# Altium project MicroSpecSensorBoard_V2_1.PrjPcb
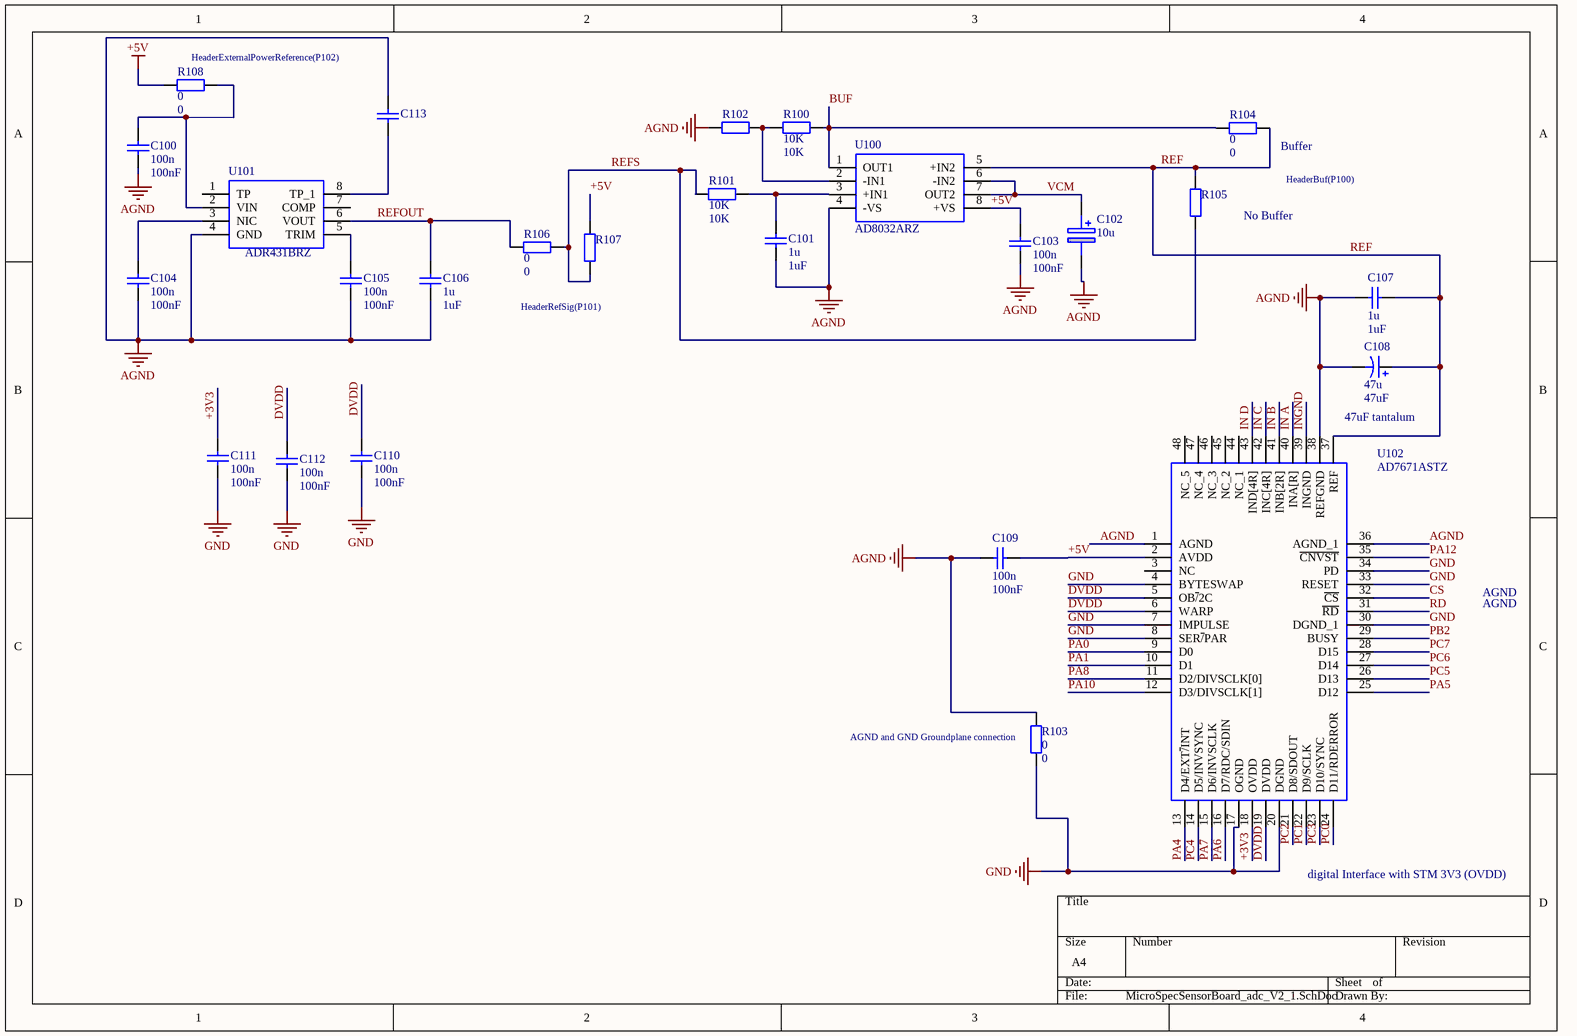
[diagram p0: MicroSpecSensorBoard_adc_V2_1.SchDoc]
5 sheets, 100 parts. Net scope: global (net labels, ports and power ports of the same name join across sheets).
Board file: MicroSpecSensorBoard_Layout_V2_1.PcbDoc
Sheets:
  MicroSpecSensorBoard_adc_V2_1.SchDoc
  MicroSpecSensorBoard_Connectors_V2_1.SchDoc
  MicroSpecSensorBoard_periphericDevices_V2_1.SchDoc
  MicroSpecSensorBoard_PowerSupply_V2_1.SchDoc
  MicroSpecSensorBoard_switch_V2_1.SchDoc

## Sheet MicroSpecSensorBoard_adc_V2_1.SchDoc
size A4

### Parts
C100  100n  value 100nF  [6-0805_L]
C101  1u  value 1uF  [6-0805_L]
C102  10u  [FKV(D)]
C103  100n  value 100nF  [6-0805_L]
C104  100n  value 100nF  [6-0805_L]
C105  100n  value 100nF  [6-0805_L]
C106  1u  value 1uF  [6-0805_L]
C107  1u  value 1uF  [6-0805_L]
C108  47u  value 47uF  [CAPCP-3216-18N]
C109  100n  value 100nF  [6-0805_L]
C110  100n  value 100nF  [6-0805_L]
C111  100n  value 100nF  [6-0805_L]
C112  100n  value 100nF  [6-0805_L]
C113  (no value)  [6-0805_N]
R100  10K  [6-0805_L]
R101  10K  [6-0805_L]
R102  (no value)  [6-0805_L]
R103  0  [6-0805_L]
R104  0  [6-0805_L]
R105  (no value)  [6-0805_L]
R106  0  [6-0805_L]
R107  (no value)  [6-0805_L]
R108  0  [6-0805_L]
U100  AD8032ARZ  [SOIC127P600X175-8N]
U101  ADR431BRZ  [SOIC127P600X175-8N]
U102  AD7671ASTZ  [QFP50P900X900X160-48N]

### Nets
+3V3: C111.1 U102.18(OVDD)
+5V: C103.1 C109.2 R107.2 R108.2 U100.8(+VS) U102.2(AVDD)
AGND: C100.2 C101.2 C102.2(-) C103.2 C104.2 C105.2 C106.2 C107.1 C108.2 C109.1 C113.1 R102.1 R103.2 U100.4(-VS) U101.4(GND) U102.1(AGND) U102.36(AGND_1) U102.38(REFGND)
GND: C110.2 C111.2 C112.2 R103.1 U102.4(BYTESWAP) U102.7(IMPULSE) U102.8(SER~{/}PAR) U102.17(OGND) U102.20(DGND) U102.30(DGND_1) U102.33(RESET) U102.34(PD)
BUF: R100.2 R104.2 U100.1(OUT1)
CS: U102.32(~{CS})
DVDD: C110.1 C112.1 U102.5(OB~{/}2C) U102.6(WARP) U102.19(DVDD)
IN A: U102.40(INA[R])
IN B: U102.41(INB[2R])
IN C: U102.42(INC[4R])
IN D: U102.43(IND[4R])
INGND: U102.39(INGND)
PA0: U102.9(D0)
PA1: U102.10(D1)
PA4: U102.13(D4/EXT~{/}INT)
PA5: U102.25(D12)
PA6: U102.16(D7/RDC/SDIN)
PA7: U102.15(D6/INVSCLK)
PA8: U102.11(D2/DIVSCLK[0])
PA10: U102.12(D3/DIVSCLK[1])
PA12: U102.35(~{CNVST})
PB2: U102.29(BUSY)
PC0: U102.24(D11/RDERROR)
PC1: U102.22(D9/SCLK)
PC2: U102.21(D8/SDOUT)
PC3: U102.23(D10/SYNC)
PC4: U102.14(D5/INVSYNC)
PC5: U102.26(D13)
PC6: U102.27(D14)
PC7: U102.28(D15)
RD: U102.31(~{RD})
REF: C107.2 C108.1 R104.1 R105.2 U100.5(+IN2) U102.37(REF)
REFOUT: C106.1 R106.2 U101.6(VOUT)
REFS: R101.1 R105.1 R106.1 R107.1
VCM: C102.1(+) U100.6(-IN2) U100.7(OUT2)
NetC100_1: C100.1 R108.1 U101.2(VIN)
NetC101_1: C101.1 R101.2 U100.3(+IN1)
NetC104_1: C104.1 U101.3(NIC)
NetC105_1: C105.1 U101.5(TRIM)
NetC113_2: C113.2 U101.8(TP_1)
NetR100_1: R100.1 R102.2 U100.2(-IN1)

Not connected (* = marked no-connect by the designer): U101 1(TP) 7(COMP); U102 3(NC) 44(NC_1) 45(NC_2) 46(NC_3) 47(NC_4) 48(NC_5)

### Notes on the sheet
- (near R108) HeaderExternalPowerReference(P102)
- (near R104) Buffer
- HeaderBuf(P100)
- (near R105) No Buffer
- HeaderRefSig(P101)
- 47uF tantalum
- AGND
- (near R103) AGND and GND Groundplane connection
- digital Interface with STM 3V3 (OVDD)

### Library data of the parts
C100 C101 C103-C107 C109-C112 = Cap: Capacitor; Published: 8-Jun-2000; LatestRevisionDate: 17-Jul-2002; LatestRevisionNote: Re-released for DXP Platform.; PackageReference: RAD-0.3; Publisher: Altium Limited; PackageDescription: Radial Cap, Thru-Hole; 2 Leads; 0.3 in Pin Spacing
C102 = EEEFK1J100P: Ecap 10uF; Manufacturer_Name: Panasonic; Allied_Number: 70256560; RS Part Number: 7083588P; Manufacturer_Part_Number: EEEFK1J100P; Datasheet Link: http://uk.rs-online.com/web/p/products/7083588P
C108 = Cap Pol2: Polarized Capacitor (Axial); Published: 8-Jun-2000; LatestRevisionDate: 17-Jul-2002; LatestRevisionNote: Re-released for DXP Platform.; PackageReference: POLAR0.8; Publisher: Altium Limited; PackageDescription: Polarized Capacitor; 2 Leads
C113 = Cap_1: Capacitor not populated; Published: 8-Jun-2000; LatestRevisionDate: 17-Jul-2002; LatestRevisionNote: Re-released for DXP Platform.; PackageReference: RAD-0.3; Publisher: Altium Limited; PackageDescription: Radial Cap, Thru-Hole; 2 Leads; 0.3 in Pin Spacing
R100 R101 R103-R108 = Res2: Resistor; Published: 8-Jun-2000; LatestRevisionDate: 17-Jul-2002; LatestRevisionNote: Re-released for DXP Platform.; PackageReference: AXIAL-0.4; Publisher: Altium Limited; PackageDescription: Axial Device, Thru-Hole; 2 Leads; 0.4 in Pin Spacing
  R100 R101: Value: 10K
  R103 R104 R106 R108: Value: 0
R102 = Res2: Resistor not populated; Published: 8-Jun-2000; LatestRevisionDate: 17-Jul-2002; LatestRevisionNote: Re-released for DXP Platform.; PackageReference: AXIAL-0.4; Publisher: Altium Limited; PackageDescription: Axial Device, Thru-Hole; 2 Leads; 0.4 in Pin Spacing
U100 = AD8032ARZ: Analog Devices AD8032ARZ, Dual Op Amp Rail-Rail, 5 V, 8-Pin SOIC; Manufacturer_Name: Analog Devices; Manufacturer_Part_Number: AD8032ARZ; RS Part Number: 0195105P; RS Price/Stock: http://uk.rs-online.com/web/p/products/0195105P; Arrow Part Number: AD8032ARZ; Arrow Price/Stock: http://uk.rs-online.com/web/p/products/0195105P; Datasheet Link: *
U101 = ADR431BRZ: ADR431BRZ, Precision Voltage Reference 2.499 to 2.501V, 0.04% 30mA 20V max. 8-Pin SOIC; Manufacturer_Name: Analog Devices; Geometry.Height: 1.75mm; Manufacturer_Part_Number: ADR431BRZ; RS Part Number: 9126366; RS Price/Stock: http://uk.rs-online.com/web/p/products/9126366; Arrow Part Number: ADR431BRZ; Arrow Price/Stock: https://www.arrow.com/en/products/adr431brz/analog-devices; Datasheet Link: http://www.analog.com/static/imported-files/data_sheets/ADR430_431_433_434_435.pdf
U102 = AD7671ASTZ: AD7671ASTZ, 16-Bit Analogue to Digital Converter, Serial, 48-Pin LQFP; Manufacturer_Name: Analog Devices; Geometry.Height: 1.6mm; Manufacturer_Part_Number: AD7671ASTZ; RS Part Number: 1580250; RS Price/Stock: http://uk.rs-online.com/web/p/products/1580250; Arrow Part Number: AD7671ASTZ; Arrow Price/Stock: https://www.arrow.com/en/products/ad7671astz/analog-devices; Datasheet Link: http://www.analog.com/static/imported-files/data_sheets/AD7671.pdf

## Sheet MicroSpecSensorBoard_Connectors_V2_1.SchDoc: Extension connectors
size A4; DocumentNumber: MB1136; Revision: C.3; SheetNumber: 4; SheetTotal: 4; Project: NUCLEO-XXXXRX
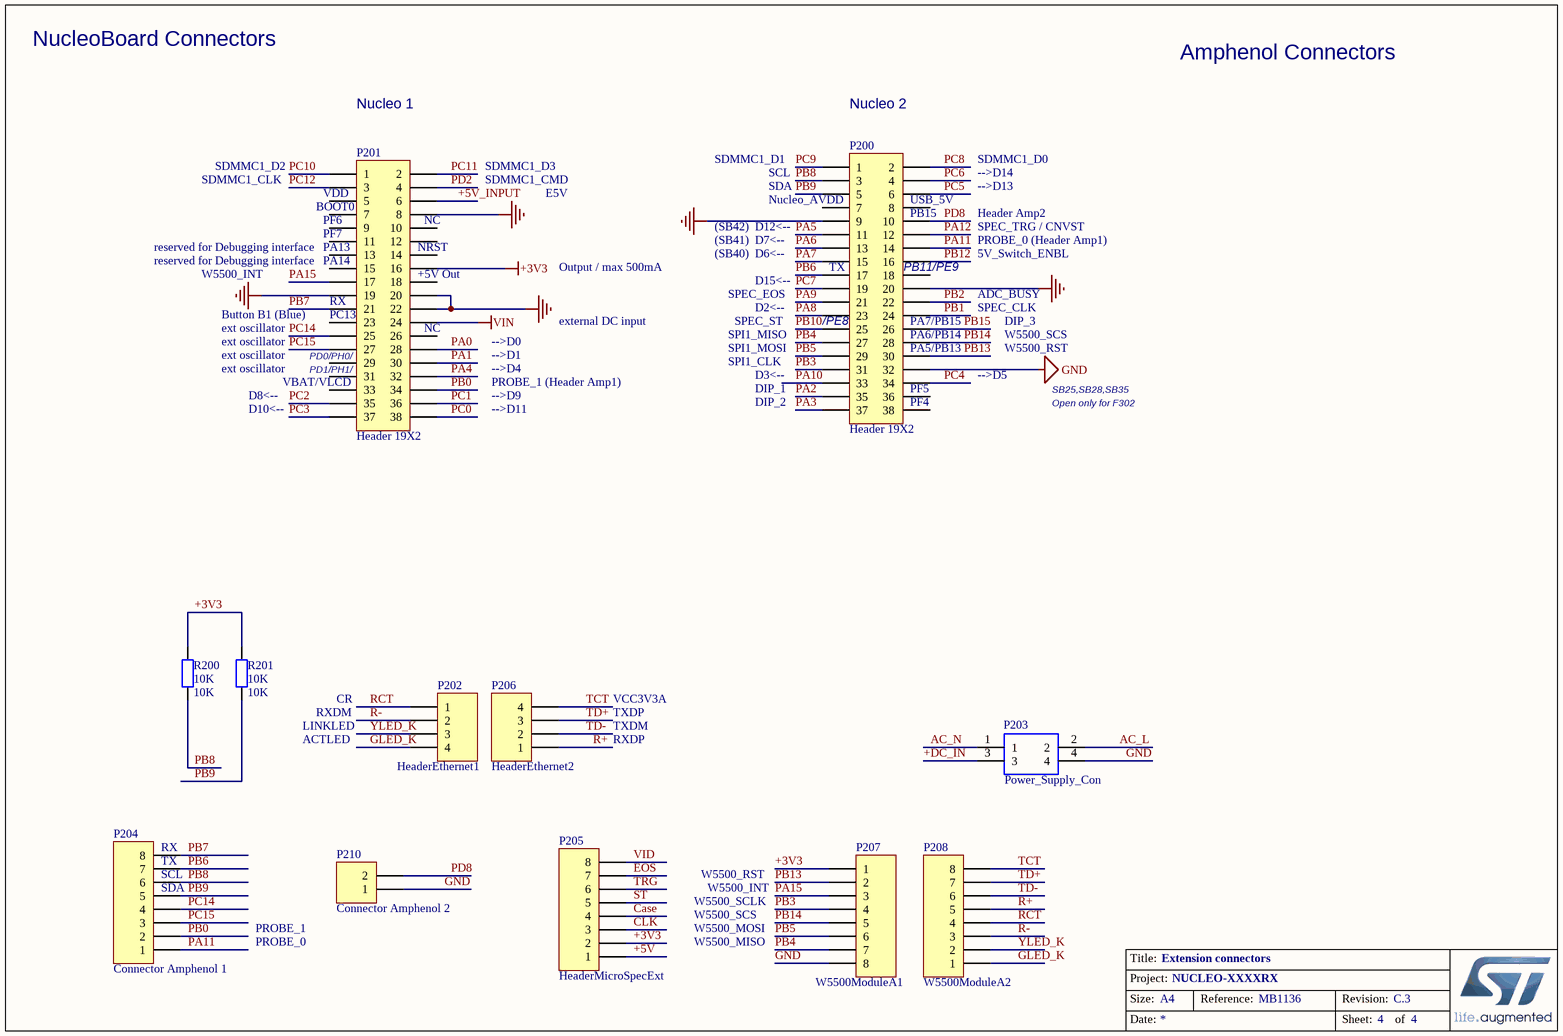
[diagram p1: MicroSpecSensorBoard_Connectors_V2_1.SchDoc]

### Parts
P200  Header 19X2  [HDR2X19]
P201  Header 19X2  [HDR2X19]
P202  HeaderEthernet1  [HDR1X4]
P203  Power_Supply_Con  [1864053]
P204  Connector Amphenol 1  [HDR1X8 - phoenix]
P205  HeaderMicroSpecExt  [HDR1X8]
P206  HeaderEthernet2  [HDR1X4]
P207  W5500ModuleA1  [HDR1X8]
P208  W5500ModuleA2  [HDR1X8]
P210  Connector Amphenol 2  [HDR1X2 - phoenix]
R200  10K  [6-0805_L]
R201  10K  [6-0805_L]

### Nets
+3V3: P201.16 P205.2 P207.1 R200.2 R201.2
+5V: P205.1
GND: P200.9 P200.20 P200.32 P201.8 P201.19 P201.20 P201.22 P203.4 P207.8 P210.1
VIN: P201.24
+5V_INPUT: P201.6
+DC_IN: P203.3
AC_L: P203.2
AC_N: P203.1
Case: P205.4
CLK: P205.3
EOS: P205.7
GLED_K: P202.4 P208.1
PA0: P201.28
PA1: P201.30
PA2: P200.35
PA3: P200.37
PA4: P201.32
PA5: P200.11
PA6: P200.13
PA7: P200.15
PA8: P200.23
PA9: P200.21
PA10: P200.33
PA11: P200.14 P204.1
PA12: P200.12
PA15: P201.17 P207.3
PB0: P201.34 P204.2
PB1: P200.24
PB2: P200.22
PB3: P200.31 P207.4
PB4: P200.27 P207.7
PB5: P200.29 P207.6
PB6: P200.17 P204.7
PB7: P201.21 P204.8
PB8: P200.3 P204.6 R200.1
PB9: P200.5 P204.5 R201.1
PB10: P200.25
PB12: P200.16
PB13: P200.30 P207.2
PB14: P200.28 P207.5
PB15: P200.26
PC0: P201.38
PC1: P201.36
PC2: P201.35
PC3: P201.37
PC4: P200.34
PC5: P200.6
PC6: P200.4
PC7: P200.19
PC8: P200.2
PC9: P200.1
PC10: P201.1
PC11: P201.2
PC12: P201.3
PC14: P201.25 P204.4
PC15: P201.27 P204.3
PD2: P201.4
PD8: P200.10 P210.2
R+: P206.1 P208.5
R-: P202.2 P208.3
RCT: P202.1 P208.4
ST: P205.5
TCT: P206.4 P208.8
TD+: P206.3 P208.7
TD-: P206.2 P208.6
TRG: P205.6
VID: P205.8
YLED_K: P202.3 P208.2

Not connected (* = marked no-connect by the designer): P200 7 8 18 36 38; P201 5 7 9 10 11 12 13 14 15 18 23 26 29 31 33

### Notes on the sheet
- NucleoBoard Connectors
- Nucleo 1
- Nucleo 2
- Amphenol Connectors
- SDMMC1_D2
- SDMMC1_D3
- SDMMC1_D1
- SCL
- SDMMC1_D0
- -->D14
- (near P201) reserved for Debugging interface
- SDMMC1_CLK
- (near P201) BOOT0
- (near P201) VDD
- (near P201) PF6
- (near P201) PF7
- (near P201) PA13
- (near P201) NRST
- (near P201) NC
- SDMMC1_CMD
- E5V
- (SB42)
- (SB41)
- D7<--
- D12<--
- SDA
- (near P200) Nucleo_AVDD
- (near P200) USB_5V
- (near P200) PB15
- -->D13
- SPEC_TRG / CNVST
- PROBE_0 (Header Amp1)
- Header Amp2
- W5500_INT
- (near P201) PA14
- (near P201) RX
- (near P201) +5V Out
- Output / max 500mA
- (SB40)
- SPEC_EOS
- D15<--
- D6<--
- D2<--
- (near P200) TX
- (near P200) PB11/PE9
- 5V_Switch_ENBL
- ADC_BUSY
- SPEC_CLK
- (near P201) ext oscillator
- (near P201) Button B1 (Blue)
- (near P201) VBAT/VLCD
- (near P201) PD0/PH0/
- (near P201) PD1/PH1/
- (near P201) PC13
- PROBE_1 (Header Amp1)
- -->D4
- -->D1
- -->D0
- external DC input
- SPI1_MISO
- SPI1_MOSI
- SPI1_CLK
- SPEC_ST
- D3<--
- (near P200) /PE8
- (near P200) PA7/PB15
- (near P200) PA6/PB14
- (near P200) PA5/PB13
- -->D5
- DIP_3
- W5500_SCS
- W5500_RST
- D8<--
- D10<--
- -->D11
- -->D9
- DIP_2
- DIP_1
- (near P200) PF5
- (near P200) PF4
- Open only for F302
- SB25,SB28,SB35
- RXDM
- CR
- VCC3V3A
- TXDP
- LINKLED
- ACTLED
- TXDM
- RXDP
- (near P204) RX
- (near P204) SCL
- (near P204) SDA
- (near P204) TX
- W5500_SCLK
- PROBE_1
- PROBE_0
- W5500_MOSI
- W5500_MISO
- Title:
- Project:
- Size:
- Date:
- A4
- Reference:
- Sheet:
- Revision:
- of

### Library data of the parts
P200 P201 = Header 19X2: Header, 19-Pin, Dual row; LatestRevisionDate: 17-Jul-2002; LatestRevisionNote: Re-released for DXP Platform.; Publisher: Altium Limited
P202 P206 = Header 4: Header, 4-Pin; LatestRevisionDate: 17-Jul-2002; LatestRevisionNote: Re-released for DXP Platform.; Publisher: Altium Limited
P203 = 1864053: Push spring connector 5mm pitch 4 way Phoenix Contact SDC Series 5mm Pitch Straight Pluggable Terminal Block, Plug with Plug In Termination, PCB Mount, 4 Way; Geometry.Height: 16mm; RS Part Number: 1113745; Manufacturer_Name: Phoenix Contact; Manufacturer_Part_Number: 1864053; Datasheet Link: http://uk.rs-online.com/web/p/products/1113745
P204 = MHDR1X8: Header, 8-Pin Phönix Contact; LatestRevisionDate: 17-Jul-2002; LatestRevisionNote: Re-released for DXP Platform.; Publisher: Altium Limited
P205 P207 P208 = Header 8: Header, 8-Pin; LatestRevisionDate: 17-Jul-2002; LatestRevisionNote: Re-released for DXP Platform.; Publisher: Altium Limited
P210 = MHDR1X2: Header, 2-Pin, MKDSN1,5 / 2, Phönix Contact; Publisher: UFZ Leipzig
R200 R201 = Res2: Resistor; Published: 8-Jun-2000; LatestRevisionDate: 17-Jul-2002; LatestRevisionNote: Re-released for DXP Platform.; PackageReference: AXIAL-0.4; Publisher: Altium Limited; PackageDescription: Axial Device, Thru-Hole; 2 Leads; 0.4 in Pin Spacing; Value: 10K

## Sheet MicroSpecSensorBoard_periphericDevices_V2_1.SchDoc
size A4
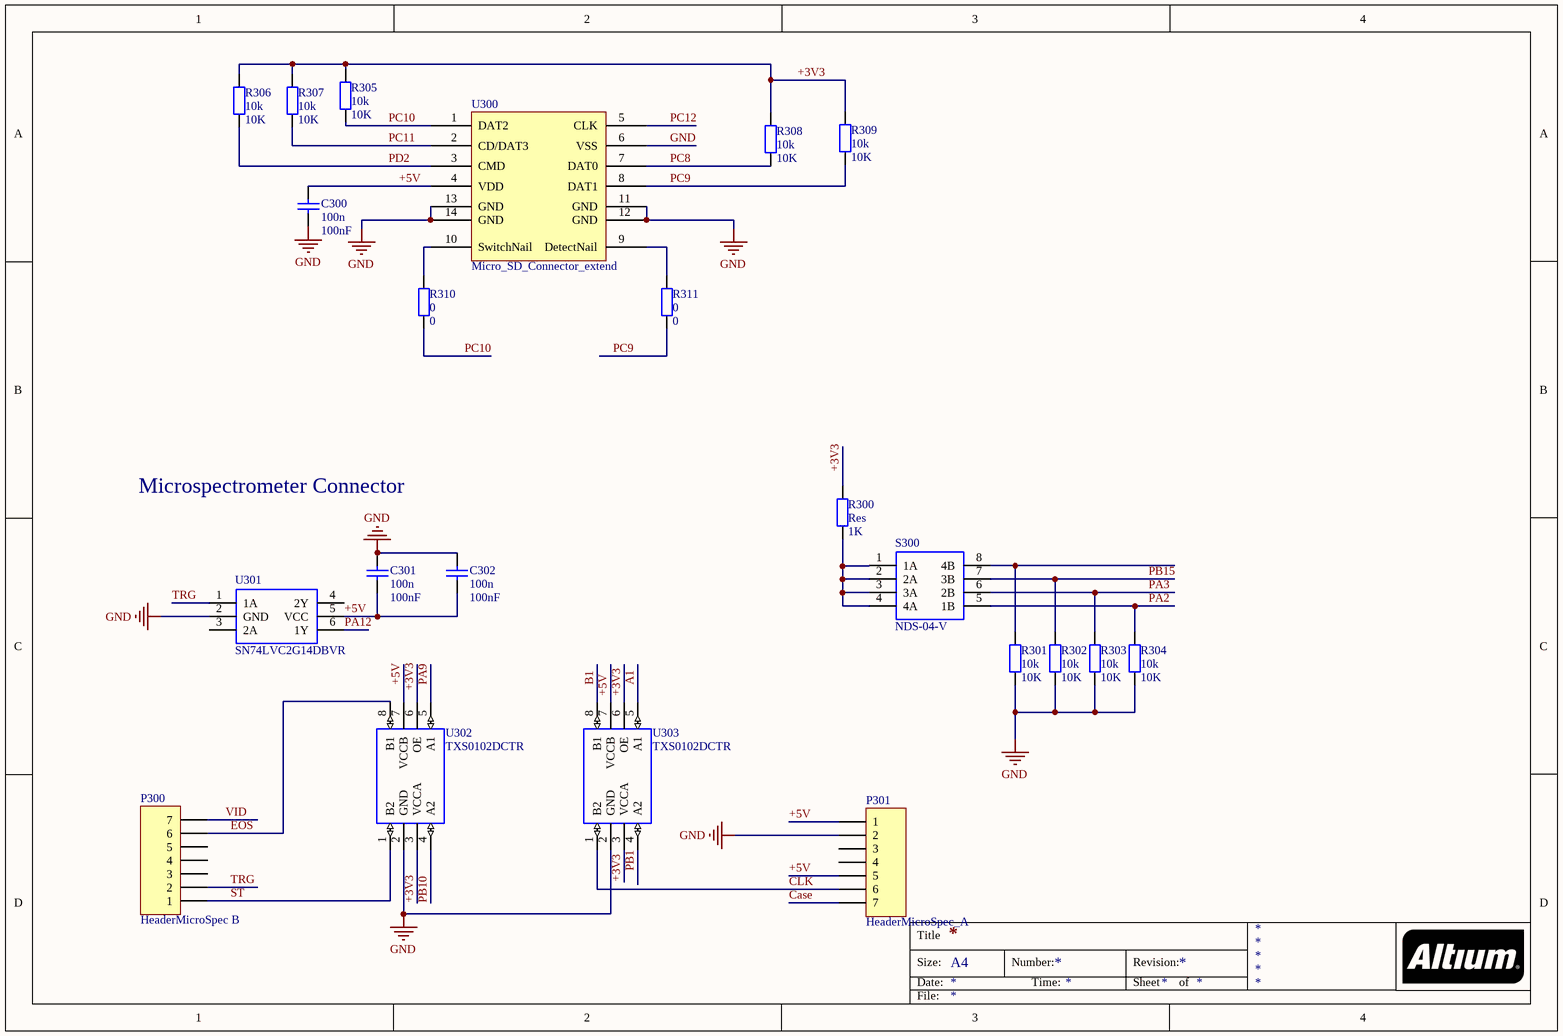
[diagram p2: MicroSpecSensorBoard_periphericDevices_V2_1.SchDoc]

### Parts
C300  100n  value 100nF  [6-0805_L]
C301  100n  value 100nF  [6-0805_L]
C302  100n  value 100nF  [6-0805_L]
P300  HeaderMicroSpec B  [HDR1X7]
P301  HeaderMicroSpec_A  [HDR1X7]
R300  Res  value 1K  [6-0805_L]
R301  10k  [6-0805_L]
R302  10k  [6-0805_L]
R303  10k  [6-0805_L]
R304  10k  [6-0805_L]
R305  10k  [6-0805_L]
R306  10k  [6-0805_L]
R307  10k  [6-0805_L]
R308  10k  [6-0805_L]
R309  10k  [6-0805_L]
R310  0  [6-0805_L]
R311  0  [6-0805_L]
S300  NDS-04-V  [DIPS762W60P254L1152H705Q8N]
U300  Micro_SD_Connector_extend  [MICRO-SD-CON-EXT]
U301  SN74LVC2G14DBVR  [SOT95P280X145-6N]
U302  TXS0102DCTR  [SOP65P400X130-8N]
U303  TXS0102DCTR  [SOP65P400X130-8N]

### Nets
+3V3: R300.2 R305.2 R306.2 R307.2 R308.1 R309.2 U302.3(VCCA) U302.6(OE) U303.3(VCCA) U303.6(OE)
+5V: C300.1 C301.2 C302.2 P301.1 P301.5 U300.4(VDD) U301.5(VCC) U302.7(VCCB) U303.7(VCCB)
GND: C300.2 C301.1 C302.1 P301.2 R301.1 R302.1 R303.1 R304.1 U300.6(VSS) U300.11(GND) U300.12(GND) U300.13(GND) U300.14(GND) U301.2(GND) U302.2(GND) U303.2(GND)
A1: U303.5(A1)
B1: U303.8(B1)
Case: P301.7
CLK: P301.6 U303.1(B2)
EOS: P300.6 U302.8(B1)
PA2: R304.2 S300.5(1B)
PA3: R303.2 S300.6(2B)
PA9: U302.5(A1)
PA12: U301.6(1Y)
PB1: U303.4(A2)
PB10: U302.4(A2)
PB15: R302.2 S300.7(3B)
PC8: R308.2 U300.7(DAT0)
PC9: R309.1 R311.1 U300.8(DAT1)
PC10: R305.1 R310.1 U300.1(DAT2)
PC11: R307.1 U300.2(CD/DAT3)
PC12: U300.5(CLK)
PD2: R306.1 U300.3(CMD)
ST: P300.1 U302.1(B2)
TRG: P300.2 U301.1(1A)
VID: P300.7
NetR300_1: R300.1 S300.1(1A) S300.2(2A) S300.3(3A) S300.4(4A)
NetR301_2: R301.2 S300.8(4B)
NetR310_2: R310.2 U300.10(SwitchNail)
NetR311_2: R311.2 U300.9(DetectNail)

Not connected (* = marked no-connect by the designer): P300 3 4 5; P301 3 4; U301 3(2A) 4(2Y)

### Notes on the sheet
- Microspectrometer Connector
- Title
- Size:
- Date:
- A4
- Number:
- Time:
- Revision:
- Sheet
- of
- File:

### Library data of the parts
C300-C302 = Cap: Capacitor; Published: 8-Jun-2000; LatestRevisionDate: 17-Jul-2002; LatestRevisionNote: Re-released for DXP Platform.; PackageReference: RAD-0.3; Publisher: Altium Limited; PackageDescription: Radial Cap, Thru-Hole; 2 Leads; 0.3 in Pin Spacing
P300 P301 = Header 7: Header, 7-Pin; LatestRevisionDate: 17-Jul-2002; LatestRevisionNote: Re-released for DXP Platform.; Publisher: Altium Limited
R300-R311 = Res2: Resistor; Published: 8-Jun-2000; LatestRevisionDate: 17-Jul-2002; LatestRevisionNote: Re-released for DXP Platform.; PackageReference: AXIAL-0.4; Publisher: Altium Limited; PackageDescription: Axial Device, Thru-Hole; 2 Leads; 0.4 in Pin Spacing
  R301-R309: Value: 10K
  R310 R311: Value: 0
S300 = NDS-04-V: Switch DIP 4 pos raised act solder 4 Way Through Hole DIP Switch SPST, Raised Actuator; Manufacturer_Name: Apem; Geometry.Height: 7.05mm; RS Part Number: 8772126; Manufacturer_Part_Number: NDS-04-V; Datasheet Link: http://uk.rs-online.com/web/p/products/8772126
U301 = SN74LVC2G14DBVR: DUAL SCHMITT-TRIGGER INVERTER; Manufacturer_Name: Texas Instruments; Manufacturer_Part_Number: SN74LVC2G14DBVR; RS Part Number: 6628926P; RS Price/Stock: http://uk.rs-online.com/web/p/products/6628926P; Arrow Part Number: SN74LVC2G14DBVR; Arrow Price/Stock: https://www.arrow.com/en/products/sn74lvc2g14dbvr/texas-instruments; Datasheet Link: http://componentsearchengine.com/Datasheets/3/SN74LVC2G14DBVR.pdf
U302 U303 = TXS0102DCTR: 2-Bit Bidirectional Voltage-Level Shifter for Open-Drain and Push-Pull Application; Manufacturer_Name: Texas Instruments; Geometry.Height: 1.3mm; Manufacturer_Part_Number: TXS0102DCTR; RS Part Number: 1628462; RS Price/Stock: http://uk.rs-online.com/web/p/products/1628462; Arrow Part Number: TXS0102DCTR; Arrow Price/Stock: https://www.arrow.com/en/products/txs0102dctr/texas-instruments; Datasheet Link: http://www.ti.com/lit/gpn/txs0102

## Sheet MicroSpecSensorBoard_PowerSupply_V2_1.SchDoc
size A4
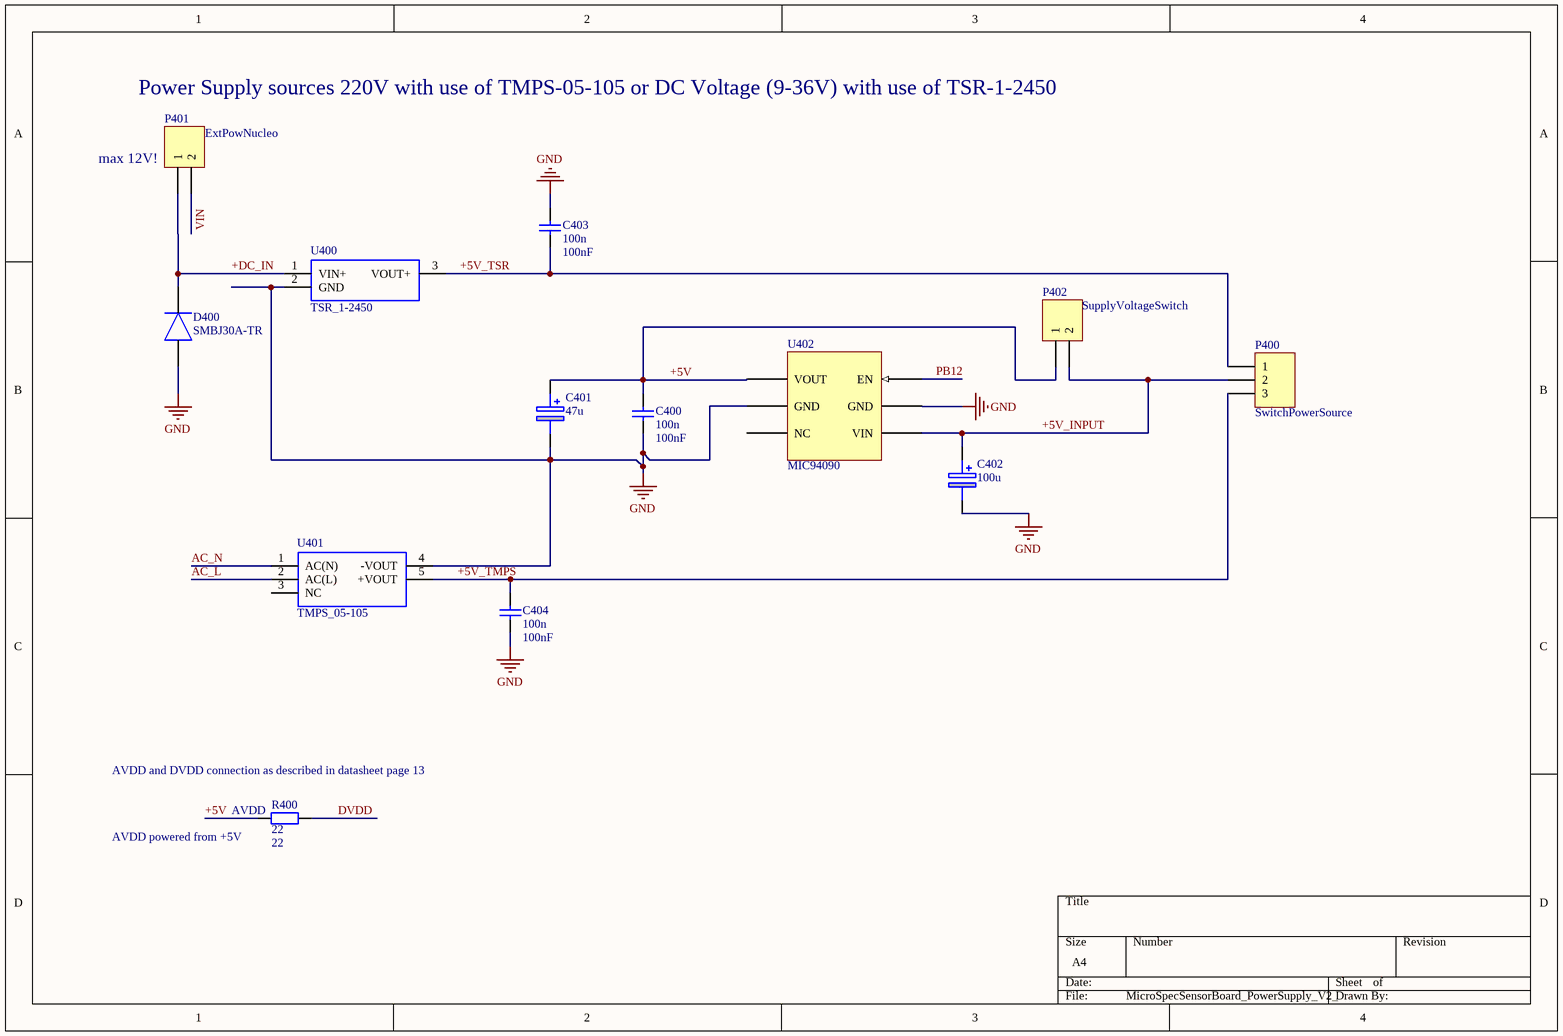
[diagram p3: MicroSpecSensorBoard_PowerSupply_V2_1.SchDoc]

### Parts
C400  100n  value 100nF  [6-0805_L]
C401  47u  [FKV(D)]
C402  100u  [FKV(D)]
C403  100n  value 100nF  [6-0805_L]
C404  100n  value 100nF  [6-0805_L]
D400  SMBJ30A-TR  [DIOM5436X265N]
P400  SwitchPowerSource  [HDR1X3]
P401  ExtPowNucleo  [HDR1X2]
P402  SupplyVoltageSwitch  [HDR1X2]
R400  22  [6-0805_L]
U400  TSR_1-2450  [TSR-1-24120]
U401  TMPS_05-105  [TMPS05-105]
U402  MIC94090  [SOT65P210X110-6N]

### Nets
+5V: C400.1 C401.1(+) P402.1 R400.1 U402.1(VOUT)
GND: C400.2 C401.2(-) C402.2(-) C403.1 C404.2 D400.2(A) U400.2(GND) U401.4(-VOUT) U402.2(GND) U402.5(GND)
VIN: P401.2
+5V_INPUT: C402.1(+) P400.2 P402.2 U402.4(VIN)
+5V_TMPS: C404.1 P400.3 U401.5(+VOUT)
+5V_TSR: C403.2 P400.1 U400.3(VOUT+)
+DC_IN: D400.1(K) P401.1 U400.1(VIN+)
AC_L: U401.2(AC(L))
AC_N: U401.1(AC(N))
DVDD: R400.2
PB12: U402.6(EN)

Not connected (* = marked no-connect by the designer): U401 3(NC); U402 3(NC)

### Notes on the sheet
- Power Supply sources 220V with use of TMPS-05-105 or DC Voltage (9-36V) with use of TSR-1-2450
- (near P401) max 12V!
- (near R400) AVDD and DVDD connection as described in datasheet page 13
- (near R400) AVDD powered from +5V
- (near R400) AVDD

### Library data of the parts
C400 C403 C404 = Cap: Capacitor; Published: 8-Jun-2000; LatestRevisionDate: 17-Jul-2002; LatestRevisionNote: Re-released for DXP Platform.; PackageReference: RAD-0.3; Publisher: Altium Limited; PackageDescription: Radial Cap, Thru-Hole; 2 Leads; 0.3 in Pin Spacing
C401 = EEEFK1J100P: Ecap 47F 63V; Manufacturer_Name: Panasonic; Allied_Number: 70256560; RS Part Number: 7083588P; Manufacturer_Part_Number: EEEFK1J100P; Datasheet Link: http://uk.rs-online.com/web/p/products/7083588P
C402 = EEEFK1J100P: Ecap 100uF 63V; Manufacturer_Name: Panasonic; Allied_Number: 70256560; RS Part Number: 7083588P; Manufacturer_Part_Number: EEEFK1J100P; Datasheet Link: http://uk.rs-online.com/web/p/products/7083588P
D400 = SMBJ30A-TR: TVS Diode Uni-Directional SMBJ30A-TR 64.3V, 600W, SMB 2-Pin; Manufacturer_Name: STMicroelectronics; Allied_Number: 70390510; Geometry.Height: 2.65mm; Manufacturer_Part_Number: SMBJ30A-TR; RS Part Number: 7141048P; RS Price/Stock: http://uk.rs-online.com/web/p/products/7141048P; Allied Price/Stock: http://www.alliedelec.com/stmicroelectronics-smbj30a-tr/70390510/; Arrow Part Number: SMBJ30A-TR; Arrow Price/Stock: https://www.arrow.com/en/products/smbj30a-tr/stmicroelectronics; Datasheet Link: http://www.st.com/web/en/resource/technical/document/datasheet/CD00001366.pdf
P400 = Header 3: Header, 3-Pin; LatestRevisionDate: 17-Jul-2002; LatestRevisionNote: Re-released for DXP Platform.; Publisher: Altium Limited
P401 P402 = Header 2: Header, 2-Pin; LatestRevisionDate: 17-Jul-2002; LatestRevisionNote: Re-released for DXP Platform.; Publisher: Altium Limited
R400 = Res2: Resistor; Published: 8-Jun-2000; LatestRevisionDate: 17-Jul-2002; LatestRevisionNote: Re-released for DXP Platform.; PackageReference: AXIAL-0.4; Publisher: Altium Limited; PackageDescription: Axial Device, Thru-Hole; 2 Leads; 0.4 in Pin Spacing; Value: 22
U400 = TSR_1-2450: Switching Regulator,6.5-32Vin,5Vout 1A Switching Regulator, 6.5 ??? 36V dc Input, 5V Output, 1A; Manufacturer_Name: Traco Power; Manufacturer_Part_Number: TSR 1-2450; RS Part Number: 6664379P; Datasheet Link: http://uk.rs-online.com/web/p/products/6664379P
U401 = TMPS_05-105: AC/DC Power Modules 5W 5Vdc 1000mA AC/DC Power module; Manufacturer_Name: Traco Power; Manufacturer_Part_Number: TMPS 05-105; RS Part Number: 8920630; RS Price/Stock: http://uk.rs-online.com/web/p/products/8920630; Arrow Part Number: TMPS 05-105; Arrow Price/Stock: http://www.arrow.com/en/products/tmps05-105/traco-power; Datasheet Link: http://assets.tracopower.com/20161031120609/TMPS05/documents/tmps05-datasheet.pdf
U402 = MIC94090: high side switch

## Sheet MicroSpecSensorBoard_switch_V2_1.SchDoc
size A4
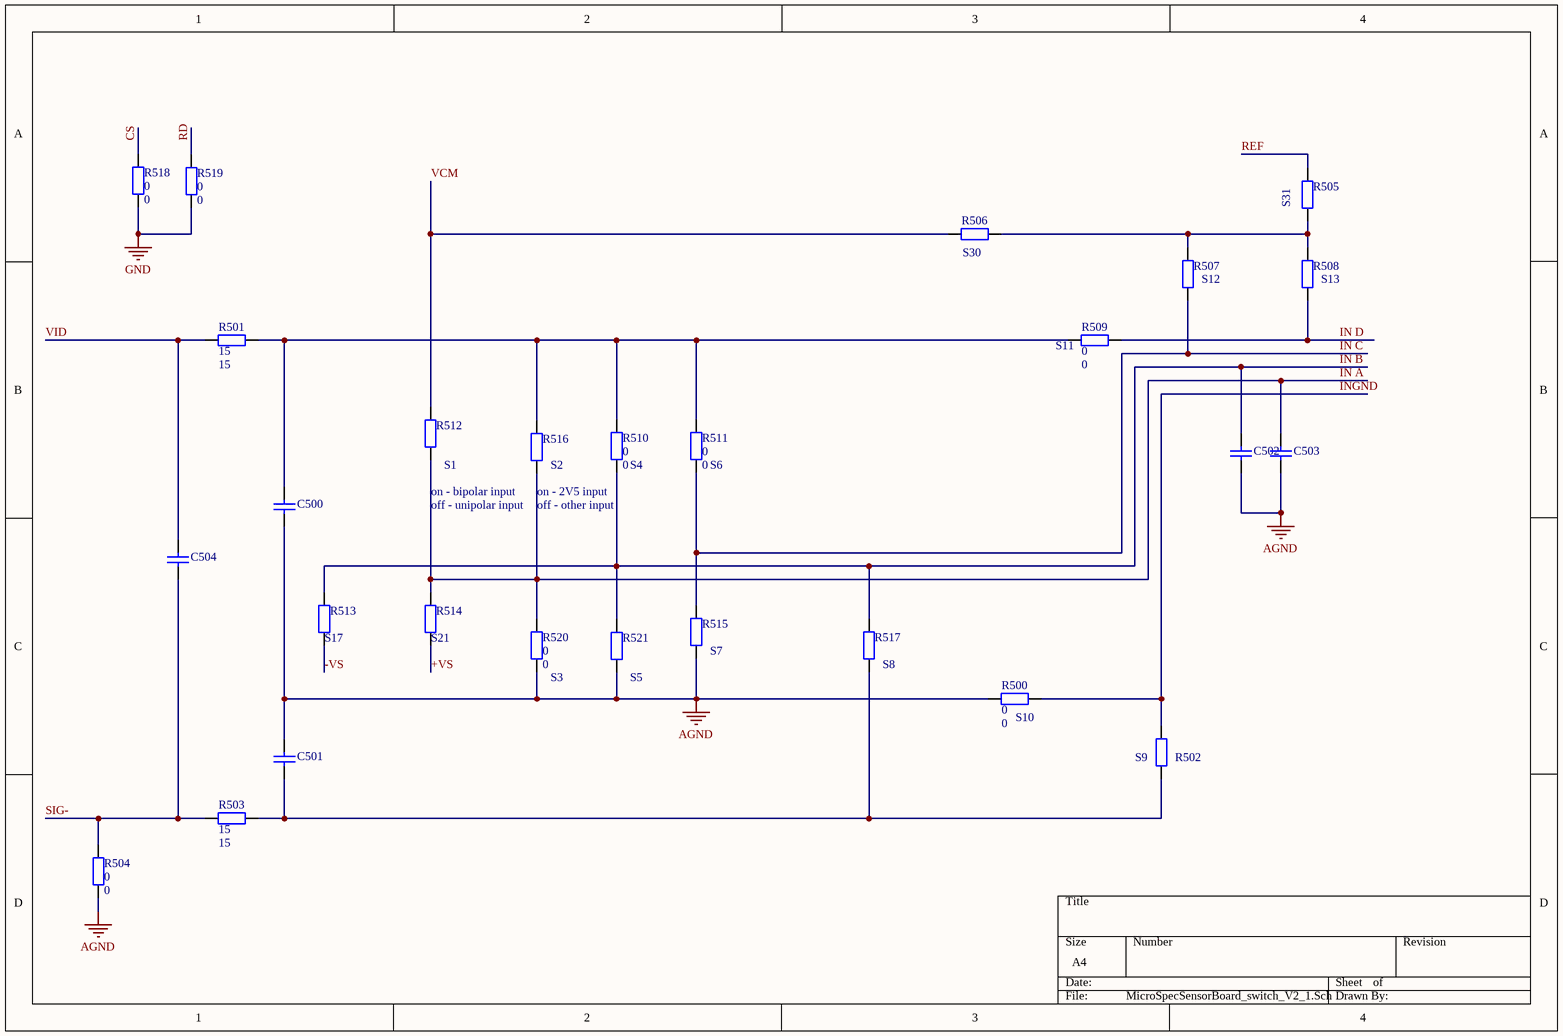
[diagram p4: MicroSpecSensorBoard_switch_V2_1.SchDoc]

### Parts
C500  (no value)  [6-0805_N]
C501  (no value)  [6-0805_N]
C502  (no value)  [6-0805_N]
C503  (no value)  [6-0805_N]
C504  (no value)  [6-0805_N]
R500  0  [6-0805_M]
R501  15  [6-0805_L]
R502  (no value)  [6-0805_M]
R503  15  [6-0805_L]
R504  0  [6-0805_L]
R505  (no value)  [6-0805_M]
R506  (no value)  [6-0805_M]
R507  (no value)  [6-0805_M]
R508  (no value)  [6-0805_M]
R509  0  [6-0805_M]
R510  0  [6-0805_M]
R511  0  [6-0805_M]
R512  (no value)  [6-0805_M]
R513  (no value)  [6-0805_M]
R514  (no value)  [6-0805_M]
R515  (no value)  [6-0805_M]
R516  (no value)  [6-0805_M]
R517  (no value)  [6-0805_M]
R518  0  [6-0805_M]
R519  0  [6-0805_M]
R520  0  [6-0805_M]
R521  (no value)  [6-0805_M]

### Nets
AGND: C500.2 C501.1 C502.2 C503.2 R500.1 R504.1 R515.1 R520.2 R521.1
GND: R518.1 R519.1
+VS: R514.1
-VS: R513.1
CS: R518.2
IN A: C503.1 R512.1 R514.2 R516.1 R520.1
IN B: C502.1 R510.2 R513.2 R517.2 R521.2
IN C: R507.1 R511.2 R515.2
IN D: R508.1 R509.2
INGND: R500.2 R502.2
RD: R519.2
REF: R505.2
SIG-: C504.2 R503.1 R504.2
VCM: R506.1 R512.2
VID: C504.1 R501.1
NetC500_1: C500.1 R501.2 R509.1 R510.1 R511.1 R516.2
NetC501_2: C501.2 R502.1 R503.2 R517.1
NetR505_1: R505.1 R506.2 R507.2 R508.2

### Notes on the sheet
- (near R505) S31
- (near R506) S30
- (near R507) S12
- (near R508) S13
- (near R509) S11
- on - bipolar input
- off - unipolar input
- (near R512) S1
- on - 2V5 input
- off - other input
- (near R516) S2
- (near R510) S4
- (near R511) S6
- (near R513) S17
- (near R514) S21
- (near R515) S7
- (near R520) S3
- (near R521) S5
- (near R517) S8
- (near R500) S10
- (near R502) S9

### Library data of the parts
C500-C504 = Cap_1: Capacitor not populated; Published: 8-Jun-2000; LatestRevisionDate: 17-Jul-2002; LatestRevisionNote: Re-released for DXP Platform.; PackageReference: RAD-0.3; Publisher: Altium Limited; PackageDescription: Radial Cap, Thru-Hole; 2 Leads; 0.3 in Pin Spacing
R500 = Res2: Resistor_S10 -place; Published: 8-Jun-2000; LatestRevisionDate: 17-Jul-2002; LatestRevisionNote: Re-released for DXP Platform.; PackageReference: AXIAL-0.4; Publisher: Altium Limited; PackageDescription: Axial Device, Thru-Hole; 2 Leads; 0.4 in Pin Spacing; Value: 0
R501 R503 R504 = Res2: Resistor; Published: 8-Jun-2000; LatestRevisionDate: 17-Jul-2002; LatestRevisionNote: Re-released for DXP Platform.; PackageReference: AXIAL-0.4; Publisher: Altium Limited; PackageDescription: Axial Device, Thru-Hole; 2 Leads; 0.4 in Pin Spacing
  R501 R503: Value: 15
  R504: Value: 0
R502 = Res2: Resistor_S9 - not place; Published: 8-Jun-2000; LatestRevisionDate: 17-Jul-2002; LatestRevisionNote: Re-released for DXP Platform.; PackageReference: AXIAL-0.4; Publisher: Altium Limited; PackageDescription: Axial Device, Thru-Hole; 2 Leads; 0.4 in Pin Spacing
R505 = Res2: Resistor_S31 -not place; Published: 8-Jun-2000; LatestRevisionDate: 17-Jul-2002; LatestRevisionNote: Re-released for DXP Platform.; PackageReference: AXIAL-0.4; Publisher: Altium Limited; PackageDescription: Axial Device, Thru-Hole; 2 Leads; 0.4 in Pin Spacing
R506 = Res2: Resistor_S30 -not place; Published: 8-Jun-2000; LatestRevisionDate: 17-Jul-2002; LatestRevisionNote: Re-released for DXP Platform.; PackageReference: AXIAL-0.4; Publisher: Altium Limited; PackageDescription: Axial Device, Thru-Hole; 2 Leads; 0.4 in Pin Spacing
R507 = Res2: Resistor_S12 -not place; Published: 8-Jun-2000; LatestRevisionDate: 17-Jul-2002; LatestRevisionNote: Re-released for DXP Platform.; PackageReference: AXIAL-0.4; Publisher: Altium Limited; PackageDescription: Axial Device, Thru-Hole; 2 Leads; 0.4 in Pin Spacing
R508 = Res2: Resistor_S13 -not place; Published: 8-Jun-2000; LatestRevisionDate: 17-Jul-2002; LatestRevisionNote: Re-released for DXP Platform.; PackageReference: AXIAL-0.4; Publisher: Altium Limited; PackageDescription: Axial Device, Thru-Hole; 2 Leads; 0.4 in Pin Spacing
R509 = Res2: Resistor_S11 -place; Published: 8-Jun-2000; LatestRevisionDate: 17-Jul-2002; LatestRevisionNote: Re-released for DXP Platform.; PackageReference: AXIAL-0.4; Publisher: Altium Limited; PackageDescription: Axial Device, Thru-Hole; 2 Leads; 0.4 in Pin Spacing; Value: 0
R510 = Res2: Resistor_S4 -place; Published: 8-Jun-2000; LatestRevisionDate: 17-Jul-2002; LatestRevisionNote: Re-released for DXP Platform.; PackageReference: AXIAL-0.4; Publisher: Altium Limited; PackageDescription: Axial Device, Thru-Hole; 2 Leads; 0.4 in Pin Spacing; Value: 0
R511 = Res2: Resistor_S6 -place; Published: 8-Jun-2000; LatestRevisionDate: 17-Jul-2002; LatestRevisionNote: Re-released for DXP Platform.; PackageReference: AXIAL-0.4; Publisher: Altium Limited; PackageDescription: Axial Device, Thru-Hole; 2 Leads; 0.4 in Pin Spacing; Value: 0
R512 = Res2: Resistor_S1 -not place; Published: 8-Jun-2000; LatestRevisionDate: 17-Jul-2002; LatestRevisionNote: Re-released for DXP Platform.; PackageReference: AXIAL-0.4; Publisher: Altium Limited; PackageDescription: Axial Device, Thru-Hole; 2 Leads; 0.4 in Pin Spacing
R513 = Res2: Resistor_S17 -not place; Published: 8-Jun-2000; LatestRevisionDate: 17-Jul-2002; LatestRevisionNote: Re-released for DXP Platform.; PackageReference: AXIAL-0.4; Publisher: Altium Limited; PackageDescription: Axial Device, Thru-Hole; 2 Leads; 0.4 in Pin Spacing
R514 = Res2: Resistor_S21 -not place; Published: 8-Jun-2000; LatestRevisionDate: 17-Jul-2002; LatestRevisionNote: Re-released for DXP Platform.; PackageReference: AXIAL-0.4; Publisher: Altium Limited; PackageDescription: Axial Device, Thru-Hole; 2 Leads; 0.4 in Pin Spacing
R515 = Res2: Resistor_Spt7 -not place; Published: 8-Jun-2000; LatestRevisionDate: 17-Jul-2002; LatestRevisionNote: Re-released for DXP Platform.; PackageReference: AXIAL-0.4; Publisher: Altium Limited; PackageDescription: Axial Device, Thru-Hole; 2 Leads; 0.4 in Pin Spacing
R516 = Res2: Resistor_S2 -not place; Published: 8-Jun-2000; LatestRevisionDate: 17-Jul-2002; LatestRevisionNote: Re-released for DXP Platform.; PackageReference: AXIAL-0.4; Publisher: Altium Limited; PackageDescription: Axial Device, Thru-Hole; 2 Leads; 0.4 in Pin Spacing
R517 = Res2: Resistor_S8 -not place; Published: 8-Jun-2000; LatestRevisionDate: 17-Jul-2002; LatestRevisionNote: Re-released for DXP Platform.; PackageReference: AXIAL-0.4; Publisher: Altium Limited; PackageDescription: Axial Device, Thru-Hole; 2 Leads; 0.4 in Pin Spacing
R518 = Res2: Resistor_CS -place; Published: 8-Jun-2000; LatestRevisionDate: 17-Jul-2002; LatestRevisionNote: Re-released for DXP Platform.; PackageReference: AXIAL-0.4; Publisher: Altium Limited; PackageDescription: Axial Device, Thru-Hole; 2 Leads; 0.4 in Pin Spacing; Value: 0
R519 = Res2: Resistor_RD -place; Published: 8-Jun-2000; LatestRevisionDate: 17-Jul-2002; LatestRevisionNote: Re-released for DXP Platform.; PackageReference: AXIAL-0.4; Publisher: Altium Limited; PackageDescription: Axial Device, Thru-Hole; 2 Leads; 0.4 in Pin Spacing; Value: 0
R520 = Res2: Resistor_S3 -place; Published: 8-Jun-2000; LatestRevisionDate: 17-Jul-2002; LatestRevisionNote: Re-released for DXP Platform.; PackageReference: AXIAL-0.4; Publisher: Altium Limited; PackageDescription: Axial Device, Thru-Hole; 2 Leads; 0.4 in Pin Spacing; Value: 0
R521 = Res2: Resistor_S5 -not place; Published: 8-Jun-2000; LatestRevisionDate: 17-Jul-2002; LatestRevisionNote: Re-released for DXP Platform.; PackageReference: AXIAL-0.4; Publisher: Altium Limited; PackageDescription: Axial Device, Thru-Hole; 2 Leads; 0.4 in Pin Spacing

## Nets that join several sheets
+3V3: MicroSpecSensorBoard_adc_V2_1 (C111.1 U102.18), MicroSpecSensorBoard_Connectors_V2_1 (5 pins), MicroSpecSensorBoard_periphericDevices_V2_1 (10 pins)
+5V: MicroSpecSensorBoard_adc_V2_1 (6 pins), MicroSpecSensorBoard_Connectors_V2_1 (P205.1), MicroSpecSensorBoard_periphericDevices_V2_1 (9 pins), MicroSpecSensorBoard_PowerSupply_V2_1 (5 pins)
AGND: MicroSpecSensorBoard_adc_V2_1 (18 pins), MicroSpecSensorBoard_switch_V2_1 (9 pins)
GND: MicroSpecSensorBoard_adc_V2_1 (12 pins), MicroSpecSensorBoard_Connectors_V2_1 (10 pins), MicroSpecSensorBoard_periphericDevices_V2_1 (16 pins), MicroSpecSensorBoard_PowerSupply_V2_1 (10 pins), MicroSpecSensorBoard_switch_V2_1 (R518.1 R519.1)
VIN: MicroSpecSensorBoard_Connectors_V2_1 (P201.24), MicroSpecSensorBoard_PowerSupply_V2_1 (P401.2)
+5V_INPUT: MicroSpecSensorBoard_Connectors_V2_1 (P201.6), MicroSpecSensorBoard_PowerSupply_V2_1 (C402.1 P400.2 P402.2 U402.4)
+DC_IN: MicroSpecSensorBoard_Connectors_V2_1 (P203.3), MicroSpecSensorBoard_PowerSupply_V2_1 (D400.1 P401.1 U400.1)
AC_L: MicroSpecSensorBoard_Connectors_V2_1 (P203.2), MicroSpecSensorBoard_PowerSupply_V2_1 (U401.2)
AC_N: MicroSpecSensorBoard_Connectors_V2_1 (P203.1), MicroSpecSensorBoard_PowerSupply_V2_1 (U401.1)
Case: MicroSpecSensorBoard_Connectors_V2_1 (P205.4), MicroSpecSensorBoard_periphericDevices_V2_1 (P301.7)
CLK: MicroSpecSensorBoard_Connectors_V2_1 (P205.3), MicroSpecSensorBoard_periphericDevices_V2_1 (P301.6 U303.1)
CS: MicroSpecSensorBoard_adc_V2_1 (U102.32), MicroSpecSensorBoard_switch_V2_1 (R518.2)
DVDD: MicroSpecSensorBoard_adc_V2_1 (5 pins), MicroSpecSensorBoard_PowerSupply_V2_1 (R400.2)
EOS: MicroSpecSensorBoard_Connectors_V2_1 (P205.7), MicroSpecSensorBoard_periphericDevices_V2_1 (P300.6 U302.8)
IN A: MicroSpecSensorBoard_adc_V2_1 (U102.40), MicroSpecSensorBoard_switch_V2_1 (5 pins)
IN B: MicroSpecSensorBoard_adc_V2_1 (U102.41), MicroSpecSensorBoard_switch_V2_1 (5 pins)
IN C: MicroSpecSensorBoard_adc_V2_1 (U102.42), MicroSpecSensorBoard_switch_V2_1 (R507.1 R511.2 R515.2)
IN D: MicroSpecSensorBoard_adc_V2_1 (U102.43), MicroSpecSensorBoard_switch_V2_1 (R508.1 R509.2)
INGND: MicroSpecSensorBoard_adc_V2_1 (U102.39), MicroSpecSensorBoard_switch_V2_1 (R500.2 R502.2)
PA0: MicroSpecSensorBoard_adc_V2_1 (U102.9), MicroSpecSensorBoard_Connectors_V2_1 (P201.28)
PA1: MicroSpecSensorBoard_adc_V2_1 (U102.10), MicroSpecSensorBoard_Connectors_V2_1 (P201.30)
PA2: MicroSpecSensorBoard_Connectors_V2_1 (P200.35), MicroSpecSensorBoard_periphericDevices_V2_1 (R304.2 S300.5)
PA3: MicroSpecSensorBoard_Connectors_V2_1 (P200.37), MicroSpecSensorBoard_periphericDevices_V2_1 (R303.2 S300.6)
PA4: MicroSpecSensorBoard_adc_V2_1 (U102.13), MicroSpecSensorBoard_Connectors_V2_1 (P201.32)
PA5: MicroSpecSensorBoard_adc_V2_1 (U102.25), MicroSpecSensorBoard_Connectors_V2_1 (P200.11)
PA6: MicroSpecSensorBoard_adc_V2_1 (U102.16), MicroSpecSensorBoard_Connectors_V2_1 (P200.13)
PA7: MicroSpecSensorBoard_adc_V2_1 (U102.15), MicroSpecSensorBoard_Connectors_V2_1 (P200.15)
PA8: MicroSpecSensorBoard_adc_V2_1 (U102.11), MicroSpecSensorBoard_Connectors_V2_1 (P200.23)
PA9: MicroSpecSensorBoard_Connectors_V2_1 (P200.21), MicroSpecSensorBoard_periphericDevices_V2_1 (U302.5)
PA10: MicroSpecSensorBoard_adc_V2_1 (U102.12), MicroSpecSensorBoard_Connectors_V2_1 (P200.33)
PA12: MicroSpecSensorBoard_adc_V2_1 (U102.35), MicroSpecSensorBoard_Connectors_V2_1 (P200.12), MicroSpecSensorBoard_periphericDevices_V2_1 (U301.6)
PB1: MicroSpecSensorBoard_Connectors_V2_1 (P200.24), MicroSpecSensorBoard_periphericDevices_V2_1 (U303.4)
PB2: MicroSpecSensorBoard_adc_V2_1 (U102.29), MicroSpecSensorBoard_Connectors_V2_1 (P200.22)
PB10: MicroSpecSensorBoard_Connectors_V2_1 (P200.25), MicroSpecSensorBoard_periphericDevices_V2_1 (U302.4)
PB12: MicroSpecSensorBoard_Connectors_V2_1 (P200.16), MicroSpecSensorBoard_PowerSupply_V2_1 (U402.6)
PB15: MicroSpecSensorBoard_Connectors_V2_1 (P200.26), MicroSpecSensorBoard_periphericDevices_V2_1 (R302.2 S300.7)
PC0: MicroSpecSensorBoard_adc_V2_1 (U102.24), MicroSpecSensorBoard_Connectors_V2_1 (P201.38)
PC1: MicroSpecSensorBoard_adc_V2_1 (U102.22), MicroSpecSensorBoard_Connectors_V2_1 (P201.36)
PC2: MicroSpecSensorBoard_adc_V2_1 (U102.21), MicroSpecSensorBoard_Connectors_V2_1 (P201.35)
PC3: MicroSpecSensorBoard_adc_V2_1 (U102.23), MicroSpecSensorBoard_Connectors_V2_1 (P201.37)
PC4: MicroSpecSensorBoard_adc_V2_1 (U102.14), MicroSpecSensorBoard_Connectors_V2_1 (P200.34)
PC5: MicroSpecSensorBoard_adc_V2_1 (U102.26), MicroSpecSensorBoard_Connectors_V2_1 (P200.6)
PC6: MicroSpecSensorBoard_adc_V2_1 (U102.27), MicroSpecSensorBoard_Connectors_V2_1 (P200.4)
PC7: MicroSpecSensorBoard_adc_V2_1 (U102.28), MicroSpecSensorBoard_Connectors_V2_1 (P200.19)
PC8: MicroSpecSensorBoard_Connectors_V2_1 (P200.2), MicroSpecSensorBoard_periphericDevices_V2_1 (R308.2 U300.7)
PC9: MicroSpecSensorBoard_Connectors_V2_1 (P200.1), MicroSpecSensorBoard_periphericDevices_V2_1 (R309.1 R311.1 U300.8)
PC10: MicroSpecSensorBoard_Connectors_V2_1 (P201.1), MicroSpecSensorBoard_periphericDevices_V2_1 (R305.1 R310.1 U300.1)
PC11: MicroSpecSensorBoard_Connectors_V2_1 (P201.2), MicroSpecSensorBoard_periphericDevices_V2_1 (R307.1 U300.2)
PC12: MicroSpecSensorBoard_Connectors_V2_1 (P201.3), MicroSpecSensorBoard_periphericDevices_V2_1 (U300.5)
PD2: MicroSpecSensorBoard_Connectors_V2_1 (P201.4), MicroSpecSensorBoard_periphericDevices_V2_1 (R306.1 U300.3)
RD: MicroSpecSensorBoard_adc_V2_1 (U102.31), MicroSpecSensorBoard_switch_V2_1 (R519.2)
REF: MicroSpecSensorBoard_adc_V2_1 (6 pins), MicroSpecSensorBoard_switch_V2_1 (R505.2)
ST: MicroSpecSensorBoard_Connectors_V2_1 (P205.5), MicroSpecSensorBoard_periphericDevices_V2_1 (P300.1 U302.1)
TRG: MicroSpecSensorBoard_Connectors_V2_1 (P205.6), MicroSpecSensorBoard_periphericDevices_V2_1 (P300.2 U301.1)
VCM: MicroSpecSensorBoard_adc_V2_1 (C102.1 U100.6 U100.7), MicroSpecSensorBoard_switch_V2_1 (R506.1 R512.2)
VID: MicroSpecSensorBoard_Connectors_V2_1 (P205.8), MicroSpecSensorBoard_periphericDevices_V2_1 (P300.7), MicroSpecSensorBoard_switch_V2_1 (C504.1 R501.1)